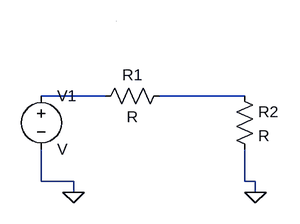
[diagram p0: schematic Draft4.asc]
Draft4.asc, the LTspice schematic file:
Version 4
SHEET 1 880 680
WIRE -16 112 -112 112
WIRE 192 112 64 112
WIRE -112 240 -112 192
WIRE -64 240 -112 240
WIRE 192 240 192 192
WIRE 208 240 192 240
WIRE -64 256 -64 240
WIRE 208 256 208 240
WIRE 0 0 0 0
FLAG 208 256 0
FLAG -64 256 0
SYMBOL res 80 96 R90
WINDOW 0 0 56 VBottom 2
WINDOW 3 32 56 VTop 2
SYMATTR InstName R1
SYMBOL res 176 96 R0
SYMATTR InstName R2
SYMBOL voltage -112 96 R0
SYMATTR InstName V1

The netlist it stands for:
* Draft4.asc
R1 N002 N001 R
R2 N002 0 R
V1 N001 0 V
.backanno
.end